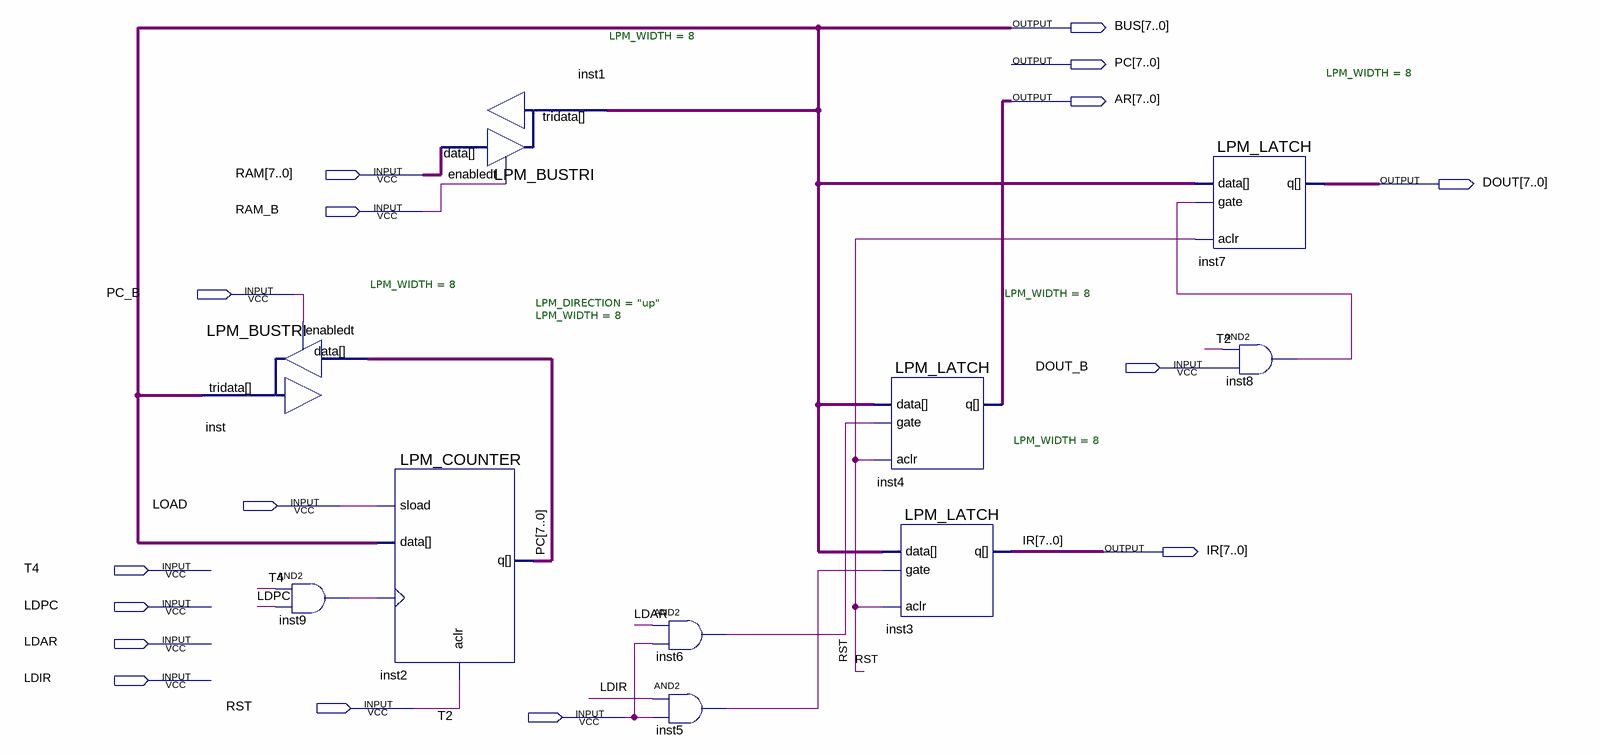
[diagram p0: schematic sheet]
// Quartus schematic GEGS_MD.bdf as structural Verilog: 10 symbols, 16 pins
module GEGS_MD (
  input  [7:0] RAM,
  input  RAM_B,
  input  PC_B,
  input  DOUT_B,
  input  LOAD,
  input  T4,
  input  LDPC,
  input  LDAR,
  input  LDIR,
  input  RST,
  input  T2,
  output [7:0] BUS,
  output [7:0] PC,
  output [7:0] AR,
  output [7:0] DOUT,
  output [7:0] IR
);

  wire inst5_out, inst6_out, inst8_out, inst9_out;

  LPM_BUSTRI #(.LPM_WIDTH(8)) inst (.data(PC), .enabledt(PC_B), .tridata(BUS));
  and inst9 (inst9_out, T4, LDPC);
  LPM_COUNTER #(.LPM_DIRECTION("up"), .LPM_WIDTH(8)) inst2 (
    .aclr(RST), .clock(inst9_out), .data(BUS), .sload(LOAD), .q(PC));
  LPM_BUSTRI #(.LPM_WIDTH(8)) inst1 (.data(RAM), .enabledt(RAM_B), .tridata(BUS));
  and inst6 (inst6_out, LDAR, T2);
  and inst5 (inst5_out, LDIR, T2);
  LPM_LATCH #(.LPM_WIDTH(8)) inst4 (.aclr(RST), .data(BUS), .gate(inst6_out), .q(AR));
  LPM_LATCH #(.LPM_WIDTH(8)) inst3 (.aclr(RST), .data(BUS), .gate(inst5_out), .q(IR));
  LPM_LATCH #(.LPM_WIDTH(8)) inst7 (.aclr(RST), .data(BUS), .gate(inst8_out), .q(DOUT));
  and inst8 (inst8_out, T2, DOUT_B);
endmodule
